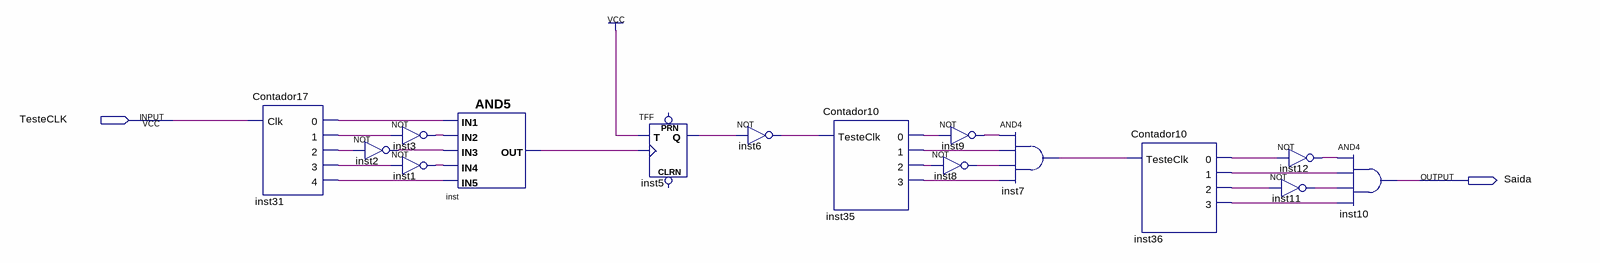
[diagram p0: schematic sheet]
// Quartus schematic Sincronizar.bdf as structural Verilog: 15 symbols, 2 pins
module Sincronizar (
  input  TesteCLK,
  output Saida
);

  wire inst1_out, inst2_out, inst3_out, inst5_q, inst6_out, inst7_out, inst8_out, inst9_out, inst11_out,
       inst12_out, inst31_0, inst31_1, inst31_2, inst31_3, inst31_4, inst35_0, inst35_1, inst35_2, inst35_3,
       inst36_0, inst36_1, inst36_2, inst36_3, inst_out;

  Contador17 inst31 (.Clk(TesteCLK), .\0 (inst31_0), .\1 (inst31_1), .\2 (inst31_2), .\3 (inst31_3), .\4 (inst31_4));
  not inst2 (inst2_out, inst31_2);
  not inst3 (inst3_out, inst31_1);
  not inst1 (inst1_out, inst31_3);
  and inst (inst_out, inst31_0, inst3_out, inst2_out, inst1_out, inst31_4);
  TFF inst5 (.T(1'b1), .CLK(inst_out), .Q(inst5_q));  // open: PRN, CLRN
  not inst6 (inst6_out, inst5_q);
  Contador10 inst35 (.TesteClk(inst6_out), .\0 (inst35_0), .\1 (inst35_1), .\2 (inst35_2), .\3 (inst35_3));
  not inst9 (inst9_out, inst35_0);
  not inst8 (inst8_out, inst35_2);
  and inst7 (inst7_out, inst9_out, inst35_1, inst8_out, inst35_3);
  Contador10 inst36 (.TesteClk(inst7_out), .\0 (inst36_0), .\1 (inst36_1), .\2 (inst36_2), .\3 (inst36_3));
  not inst12 (inst12_out, inst36_0);
  not inst11 (inst11_out, inst36_2);
  and inst10 (Saida, inst12_out, inst36_1, inst11_out, inst36_3);
endmodule
